# EAGLE schematic RC_shield (EAGLE 7.1.0)
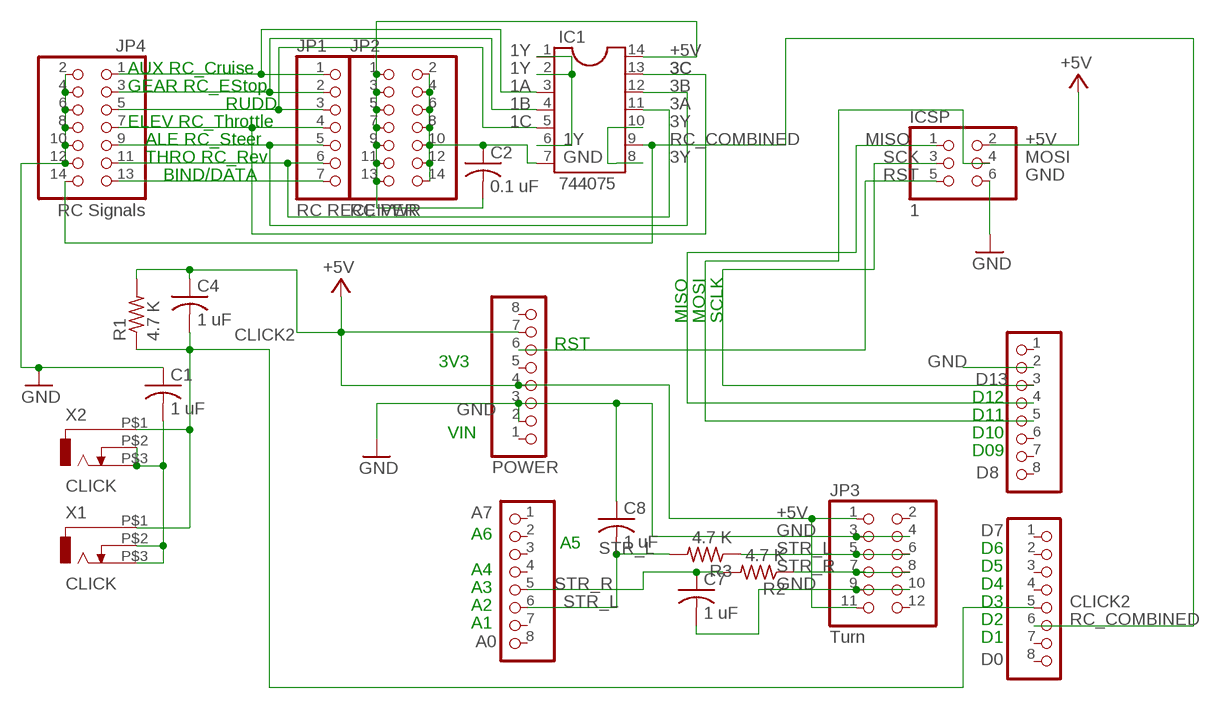
[diagram p0: schematic, sheet 1]

## Parts
A0  A7  PINHD-1X8  [1X08]
C1  1 uF  C-US025-030X050  [C025-030X050]
C2  0.1 uF  C-US025-030X050  [C025-030X050]
C4  1 uF  C-US025-030X050  [C025-030X050]
C7  1 uF  C-US025-030X050  [C025-030X050]
C8  1 uF  C-US025-030X050  [C025-030X050]
D0  D7  PINHD-1X8  [1X08]
D8  D13  PINHD-1X8  [1X08]
IC1  744075  DIL14  [DIL14]
ICSP  1  PINHD-2X3  [2X03]
JP1  RC RECEIVER  PINHD-1X7  [1X07]
JP2  RC PWR  PINHD-2X7  [2X07]
JP3  Turn  PINHD-2X6  [2X06]
JP4  RC Signals  PINHD-2X7  [2X07]
POWER  GND  PINHD-1X8  [1X08]
R1  4.7 K  R-US_0207/10  [0207/10]
R2  4.7 K  R-US_0207/10  [0207/10]
R3  4.7 K  R-US_0207/10  [0207/10]
X1  CLICK  ODO_JACK  [ODO_JACK]
X2  CLICK  ODO_JACK  [ODO_JACK]

## Nets
1A: IC1.3 JP1.1 JP4.1
1B: IC1.4 JP1.2 JP4.3
1C: IC1.5 JP1.3 JP4.5
1Y: IC1.1 IC1.2 IC1.6
3A: IC1.11 JP1.6 JP4.11
3B: IC1.12 JP1.5 JP4.9
3C: IC1.13 JP1.4 JP4.7
3Y: IC1.8 IC1.10
+5V: C2.2 C4.1 IC1.14 ICSP.2 JP2.1 JP2.3 JP2.5 JP2.7 JP2.9 JP2.11 JP2.13 JP3.1 JP3.11 POWER.4 POWER.7 R1.2
CLICK2: C4.2 D0.5 R1.1 X1.P$1 X2.P$1
GND: C1.1 C2.1 C7.2 C8.1 D8.2 IC1.7 ICSP.6 JP2.2 JP2.4 JP2.6 JP2.8 JP2.10 JP2.12 JP2.14 JP3.3 JP3.4 JP3.9 JP3.10 JP4.2 JP4.4 JP4.6 JP4.8 JP4.10 JP4.12 POWER.2 POWER.3
MISO: D8.4 ICSP.1
MOSI: D8.5 ICSP.4
N$1: JP3.7 JP3.8 R2.1
N$2: JP3.5 JP3.6 R3.1
N$3: JP1.7 JP4.13
N$23: C1.2 X1.P$2 X1.P$3 X2.P$2 X2.P$3
RC_COMBINED: D0.6 IC1.9 JP4.14
RST: ICSP.5 POWER.6
SCK: D8.3 ICSP.3
STR_L: A0.6 C8.2 R3.2
STR_R: A0.5 C7.1 R2.2
Unconnected: A0.1 A0.2 A0.3 A0.4 A0.7 A0.8 D0.1 D0.2 D0.3 D0.4 D0.7 D0.8 D8.1 D8.6 D8.7 D8.8 JP3.2 JP3.12 POWER.1 POWER.5 POWER.8

## Notes on the sheet
- AUX RC_Cruise
- GEAR RC_EStop
- RUDD
- ELEV RC_Throttle
- ALE RC_Steer
- THRO RC_Rev
- BIND/DATA
- MISO | MOSI | SCLK
- RST
- 3V3
- D12
- D11
- VIN | D10
- D09
- A6
- A5
- D6
- A4
- D5
- A3
- D4
- A2
- D3
- A1
- D2
- D1

## Library data of the parts
A0 D0 D8 POWER = pinhead:PINHD-1X8: PIN HEADER
C1 C2 C4 C7 C8 = rcl:C-US: CAPACITOR, American symbol
IC1 = ic-package:DIL14: Dual In Line / Socket
ICSP = pinhead:PINHD-2X3: PIN HEADER
JP1 = pinhead:PINHD-1X7: PIN HEADER
JP2 JP4 = pinhead:PINHD-2X7: PIN HEADER
JP3 = pinhead:PINHD-2X6: PIN HEADER
R1-R3 = rcl:R-US_: RESISTOR, American symbol
X1 X2 = Elcano:ODO_JACK

## Net classes
0 default: width 0.152 mm, drill 0.305 mm, clearance 0.152 mm